# Altium schematic sheet Serial Board Overview.SchDoc
size A; Organization: Underwater Robotics; Address1: c/o Student Involvement; Address2: Campus Box 7306; Address3: 2016 Cates Ave. Raleigh, NC 27695; Revision: A1; SheetNumber: 1D; SheetTotal: 4D
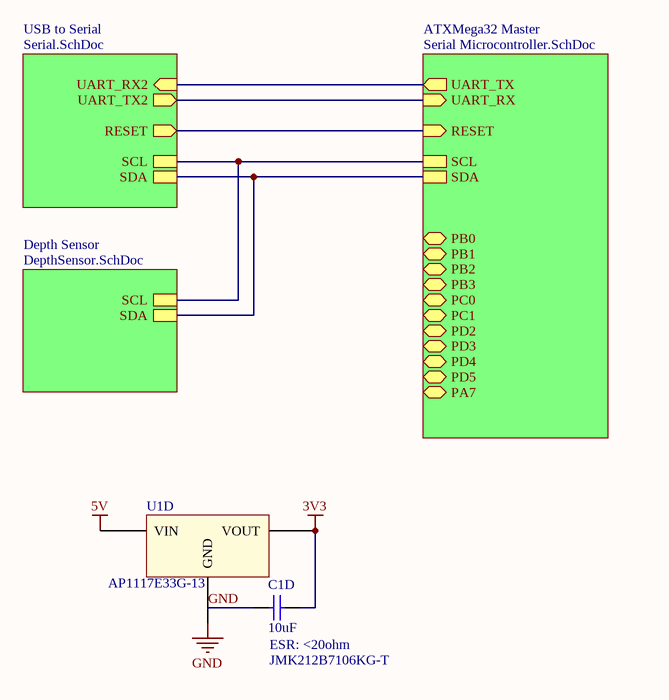
[diagram p0: Serial Board Overview.SchDoc]

## Parts
C1D  value 10uF  ESR: <20ohm  Manufacturer Part Number: JMK212B7106KG-T  [C0805]  (hidden comment: .1uF)
U1D  AP1117E33G-13  [AP1117]

## Sub-sheets
ATXMega32 Master = Serial Microcontroller.SchDoc: UART_TX (out), UART_RX (in), RESET (in), SCL, SDA, PC1 (bidir), PA7 (bidir), PD5 (bidir), PB2 (bidir), PD3 (bidir), PB0 (bidir), PC0 (bidir), PD4 (bidir), PB1 (bidir), PD2 (bidir), PB3 (bidir)
Depth Sensor = DepthSensor.SchDoc: SDA, SCL
USB to Serial = Serial.SchDoc: UART_RX2 (in), UART_TX2 (out), RESET (out), SCL, SDA

## Nets
3V3: C1D.1 U1D.VOUT
5V: U1D.VIN
GND: C1D.2 U1D.GND
(unnamed): sheet USB to Serial/UART_RX2, sheet ATXMega32 Master/UART_TX
(unnamed): sheet USB to Serial/UART_TX2, sheet ATXMega32 Master/UART_RX
(unnamed): sheet USB to Serial/RESET, sheet ATXMega32 Master/RESET
(unnamed): sheet USB to Serial/SCL, sheet ATXMega32 Master/SCL, sheet Depth Sensor/SCL
(unnamed): sheet USB to Serial/SDA, sheet ATXMega32 Master/SDA, sheet Depth Sensor/SDA

## Notes on the sheet
- Title
- Size:
- Date:
- A
- Number:
- Time:
- Revision:
- Sheet
- of
- File:

## Library data of the parts
C1D = Cap: Unpolarized Capacitor; Manufacturer 1: TAIYO YUDEN; Description 1: TAIYO YUDEN - JMK212B7106KG-T - CERAMIC CAPACITOR, 10UF, 6.3V, X7R, 10%, 0805; Product Range: M Series; Capacitance: 10 F; Capacitance Tolerance: 10%; Dielectric Characteristic: X7; Voltage Rating: 6.3; Ceramic Capacitor Case: 0805 [2012 Metric]; Supplier 1: Newark; Supplier Part Number 1: 84R9126; RoHS: YES; Stock 1: 492; Pricing 1: 1=0.13, 10=0.12, 50=0.112, 100=0.105, 500=0.083, 1000=0.068 (USD); Packaging: Cut Tape; ComponentLink1URL: http://www.farnell.com/datasheets/1910934.pdf; ComponentLink1Description: http://www.farnell.com/datasheets/1910934.pdf
U1D = AP1117E33G-13: 3.3V 1A Linear Regulator; Manufacturer 1: DIODES INC.; Description 1: DIODES INC. - AP1117E33G-13 - IC, LDO, REG, 3.3V, SOT223; Input Voltage Min: 4.8; Input Voltage Max: 18; Output Voltage Nom.: 3.3; Output Current: 1; Dropout Voltage Vdo: 1.3; LDO Regulator Case Style: SOT-223; No. of Pins: 3; Supplier 1: Newark; Supplier Part Number 1: 79R5845; Manufacturer Part Number: AP1117E33G-13; RoHS: YES; Stock 1: 8573; Pricing 1: 1=0.444, 10=0.324, 100=0.204, 250=0.151, 500=0.123, 1000=0.095 (USD); Operating Temperature Min: 0; ComponentLink1URL: http://www.farnell.com/datasheets/608751.pdf; ComponentLink1Description: http://www.farnell.com/datasheets/608751.pdf